# EAGLE design IRHapticFeedbackBoard (EAGLE 7.4.0)
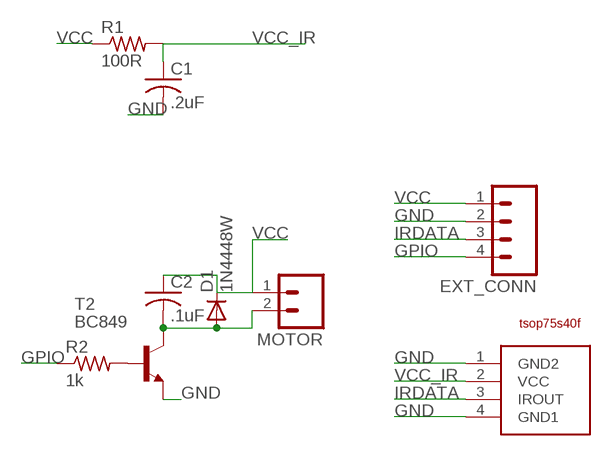
[diagram p0: schematic, sheet 1]

## Parts
C1  .2uF  C-USC0603  [C0603]
C2  .1uF  C-USC0603  [C0603]
D1  1N4448W  DIODE-SOD-123  [SOD-123]
EXT_CONN  M04PTH  [1X04]
MOTOR  M02PTH  [1X02]
R1  100R  R-US_R0603  [R0603]
R2  1k  R-US_R0603  [R0603]
T2  BC849  [SOT23]
U$1  TSOP75S40F  [TSOP75S40F]

## Nets
GND: C1.2 EXT_CONN.2 T2.2(E) U$1.1(GND2) U$1.4(GND1)
GPIO: EXT_CONN.4 R2.1
IRDATA: EXT_CONN.3 U$1.3(IROUT)
N$1: R2.2 T2.1(B)
N$4: C2.2 D1.A MOTOR.2 T2.3(C)
VCC: C2.1 D1.C EXT_CONN.1 MOTOR.1 R1.1
VCC_IR: C1.1 R1.2 U$1.2(VCC)

## Library data of the parts
C1 C2 = adafruit:C-US: CAPACITOR, American symbol
D1 = dp_devices:DIODE: Various Diode Packages
EXT_CONN = BryanConnectors:M04: Header 4 Standard 4-pin 0.1" header. Use with straight break away headers (SKU : PRT-00116), right angle break away headers (PRT-00553), swiss pins (PRT-00743), machine pins (PRT-00117), and female headers (PRT-00115). Molex polarized connector foot print use with SKU : PRT-08231 with associated crimp pins and housings. 1MM SMD Version SKU: PRT-10208
MOTOR = BryanConnectors:M02: Standard 2-pin 0.1" header. Use with - straight break away headers ( PRT-00116) - right angle break away headers (PRT-00553) - swiss pins (PRT-00743) - machine pins (PRT-00117) - female headers (PRT-00115) Molex polarized connector foot print use with: PRT-08233 with associated crimp pins and housings. 2.54_SCREWTERM for use with PRT-10571. 3.5mm Screw Terminal footprints for PRT-08084 5mm Screw Terminal footprints for use with PRT-08432
R1 R2 = adafruit:R-US_: RESISTOR, American symbol
T2 = transistor:BC849: NPN TRANSISTOR
U$1 = VisayIR:TSOP75S40F

## Board
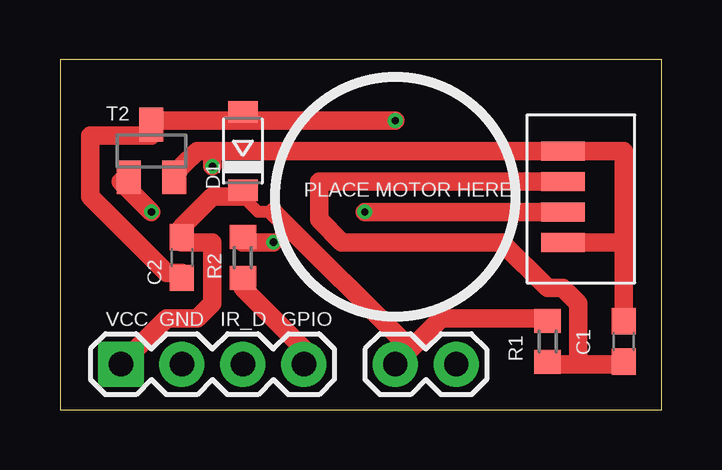
[diagram p1: board, top side]
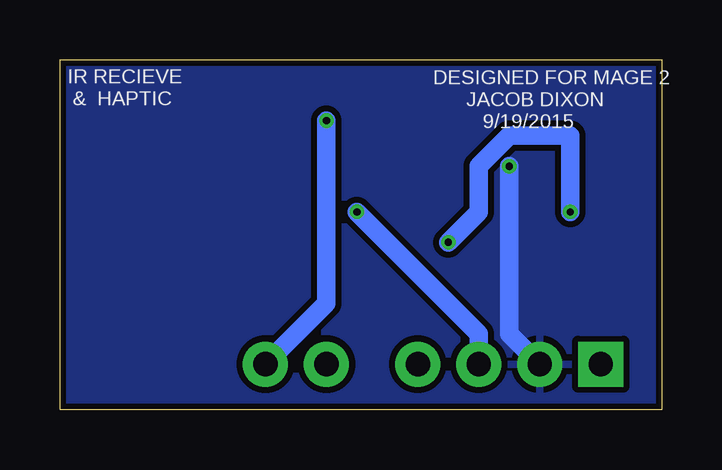
[diagram p2: board, bottom side, seen from below]

Size 25.07 x 14.6 mm. Coordinates in mm from the lower left corner, seen from the top.
Outline: 0,0 25.07,0 25.07,14.6 0,14.6 0,0
Copper layers (1*16): Top 0.035mm / dielectric 1.5mm / Bottom 0.035mm
Design rules "dirt_cheap_dirty_boards.v1 *": minimum track width 30mil, minimum drill 12mil, track to track 5mil, track to pad 5mil, pad to pad 5mil, via to via 5mil, smd to smd 0mil, copper to edge 10mil, drill to drill 10mil, minimum pad ring 10mil, minimum via ring 6mil, stop-mask expansion 2mil, vias tented up to drill 25mil, thermal gap 10mil

### Footprints (pad centres in the part's own frame; a part is rotated, then mirrored left to right if it is on the bottom)
C0603 = smd 1.1 x 1: 1 -0.85,0; 2 0.85,0
SOD-123 = smd 0.91 x 1.22: A 1.635,0; C -1.635,0
1X04 = drill 1.016 pad 1.88 square: 1 0,0 | drill 1.016 pad 1.88: 2 2.54,0; 3 5.08,0; 4 7.62,0
1X02 = drill 1.016 pad 1.88: 1 0,0; 2 2.54,0
R0603 = smd 1 x 1.1: 1 -0.85,0; 2 0.85,0
SOT23 = smd 1 x 1.4: 1 -0.95,-1.1; 2 0.95,-1.1; 3 0,1.1
TSOP75S40F = smd 0.8 x 1.8: 1 0,0; 2 1.27,0; 3 2.54,0; 4 3.81,0

### Placement (x,y rotation side)
C1  23.5,2.86 90 top
C2  5.08,6.35 270 top
D1  7.62,10.79 90 top
EXT_CONN  2.54,1.91 0 top
MOTOR  13.97,1.91 0 top
R1  20.32,2.86 270 top
R2  7.62,6.35 90 top
T2  3.81,10.79 0 top
U$1  20.95,10.79 270 top

### Tracks (layer width: path | path; a pad name or v marks a point on that pad's centre or on a via)
GND  (via drill 0.3)
  Top 0.762: 23.5,6.99 C1.2 | U$1.4 23.5,6.99 | 6.35,10.79 U$1.1 23.5,10.79 23.5,6.99 | 6.35,10.79 5.71,10.79 5.08,10.16 T2.2 | 6.35,10.79 v6.35,10.16
  Bottom 0.762: EXT_CONN.2 6.35,3.17 v6.35,10.16
  pour Bottom (isolate 0.254): 0,14.61 25.08,14.61 25.08,0 0,0
GPIO
  Top 0.762: EXT_CONN.4 10.16,2.54 7.62,5.08 R2.1
IRDATA  (via drill 0.3)
  Top 0.762: v12.7,8.26 U$1.3
  Bottom 0.762: v12.7,8.26 7.62,3.17 EXT_CONN.3
N$1  (via drill 0.3)
  Top 0.762: v8.89,6.99 7.62,6.99 R2.2 | v3.81,8.26 2.54,9.53 T2.1
  Bottom 0.762: v8.89,6.99 7.62,8.26 7.62,10.16 6.35,11.43 3.81,11.43 v3.81,8.26
N$4  (via drill 0.3)
  Top 0.762: C2.2 5.08,5.71 4.45,5.71 1.27,8.89 1.27,11.43 3.81,11.43 T2.3 3.81,12.06 7.62,12.06 | 7.62,12.06 v13.97,12.06 | 7.62,12.06 D1.A
  Bottom 0.762: MOTOR.2 13.97,4.45 v13.97,12.06
VCC
  Top 0.508: 7.62,8.89 8.26,8.26 8.89,8.26
  Top 0.762: 14.61,2.54 15.88,3.81 20.32,3.81 R1.1 | 14.61,2.54 8.89,8.26 | D1.C 7.62,8.89 6.35,8.89 5.08,7.62 C2.1 5.08,6.99 6.35,6.99 6.35,4.45 5.71,3.81 4.45,3.81 EXT_CONN.1 | 14.61,2.54 MOTOR.1
VCC_IR
  Top 0.762: 21.59,1.91 23.5,1.91 C1.1 | 21.59,1.91 20.32,1.91 R1.2 | U$1.2 10.79,9.53 10.79,7.94 11.75,6.99 18.41,6.99 20.32,5.08 20.95,5.08 21.59,4.45 21.59,1.91

### Text on the board
tNames: PLACE MOTOR HERE | VCC | GND | IR_D | GPIO
_bsilk: IR RECIEVE / & HAPTIC | DESIGNED FOR MAGE 2 / JACOB DIXON / 9/19/2015